# EAGLE design source_eagle (EAGLE 9.6.2)
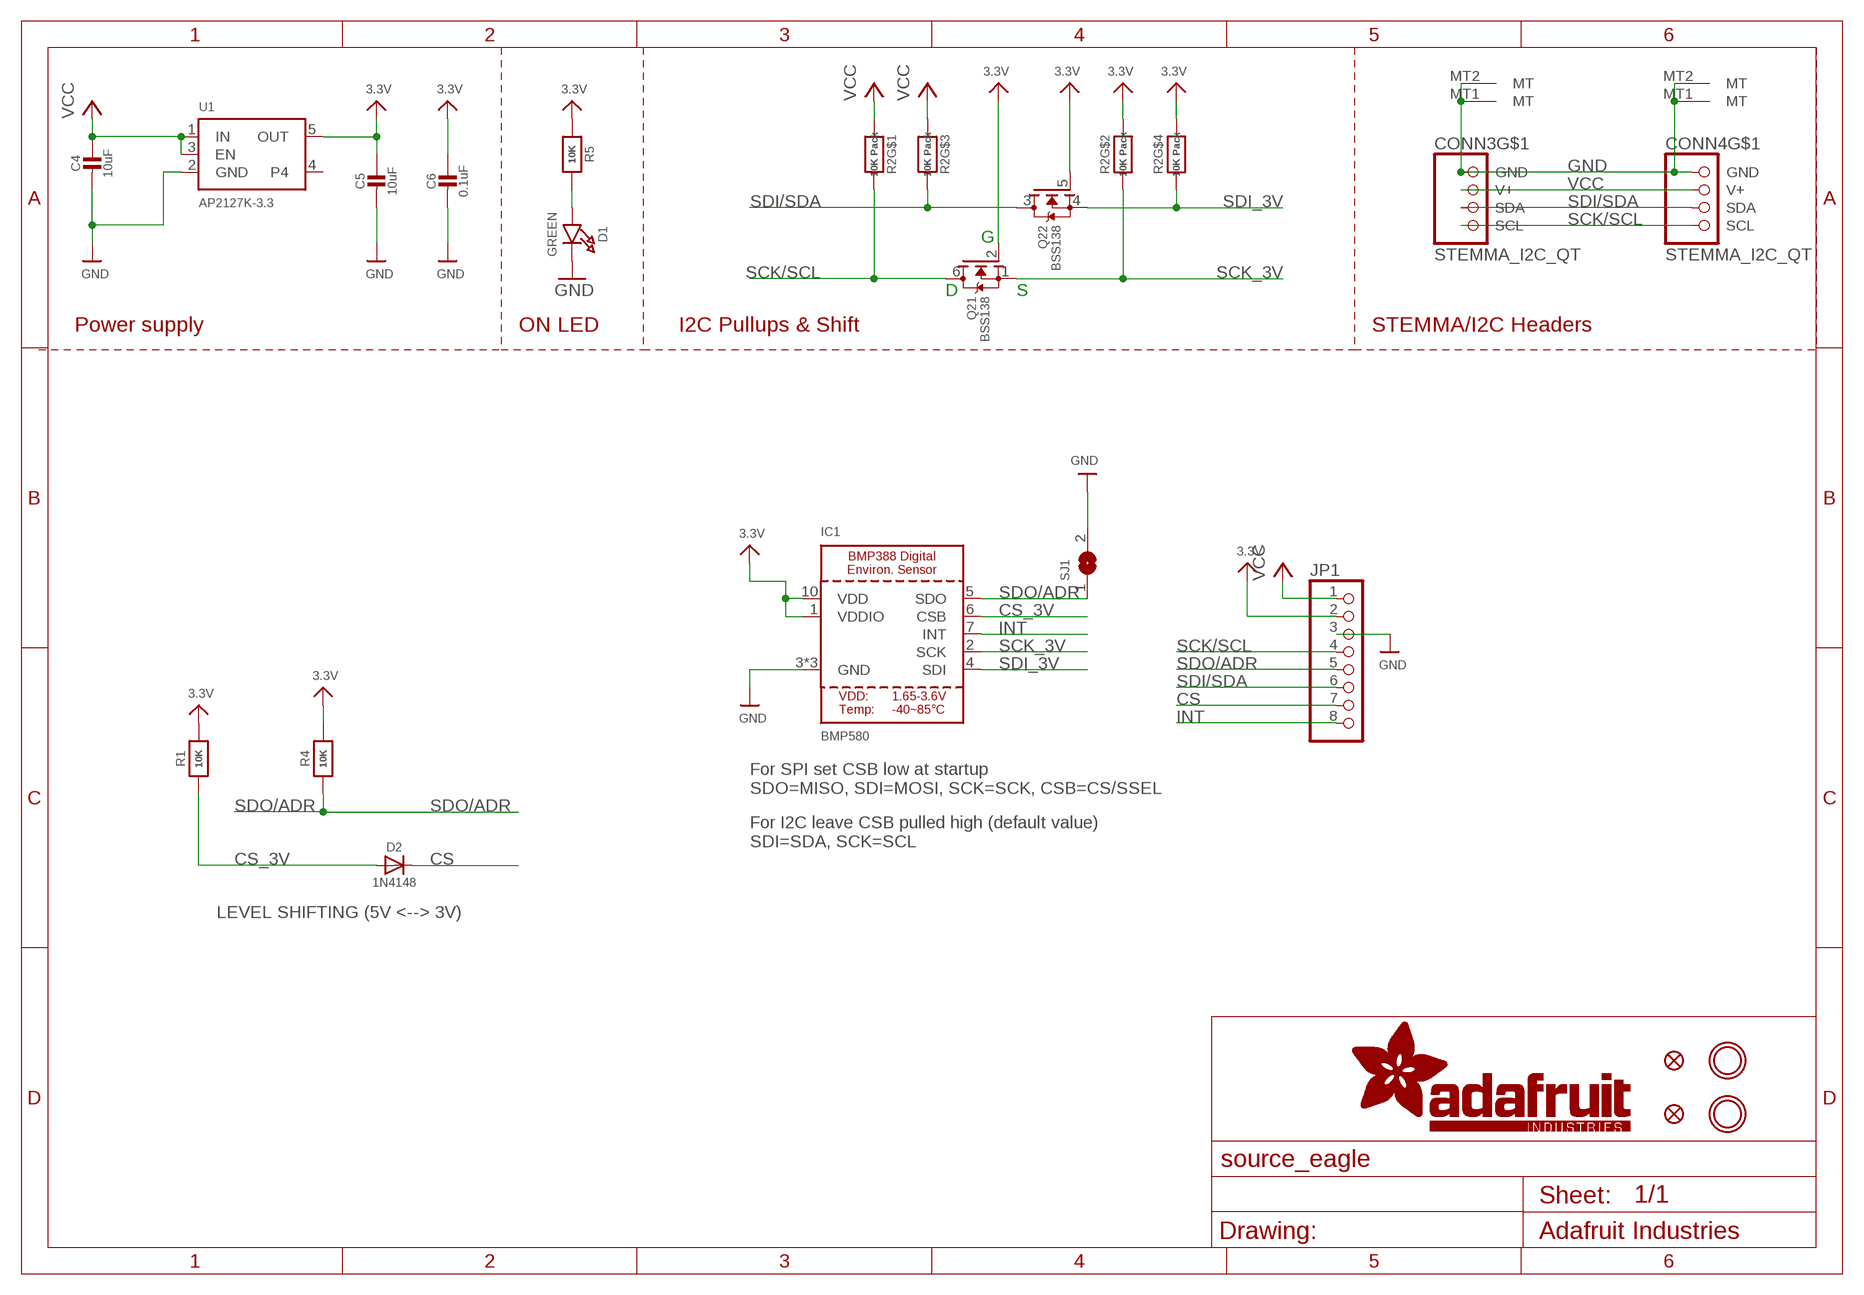
[diagram p0: schematic, sheet 1]

## Parts
C4  10uF  CAP_CERAMIC0805-NOOUTLINE  [0805-NO]
C5  10uF  CAP_CERAMIC0805-NOOUTLINE  [0805-NO]
C6  0.1uF  CAP_CERAMIC0603_NO  [0603-NO]
CONN3  STEMMA_I2C_QT  [JST_SH4]
CONN4  STEMMA_I2C_QT  [JST_SH4]
D1  GREEN  LED0603_NOOUTLINE  [CHIPLED_0603_NOOUTLINE]
D2  1N4148  DIODESOD-323  [SOD-323]
FID3  FIDUCIAL_1MM  [FIDUCIAL_1MM]
FID4  FIDUCIAL_1MM  [FIDUCIAL_1MM]
IC1  BMP580  BMP388  [BMP388]
JP1  HEADER-1X870MIL  [1X08_ROUND_70]
Q2  BSS138  MOSFET-N_DUAL  [SOT363]
R1  10K  RESISTOR_0603_NOOUT  [0603-NO]
R2  10K Pack  RESISTOR_4PACK  [RESPACK_4X0603]
R4  10K  RESISTOR_0603_NOOUT  [0603-NO]
R5  10K  RESISTOR_0603_NOOUT  [0603-NO]
SJ1  SOLDERJUMPER  [SOLDERJUMPER_ARROW_NOPASTE]
U1  AP2127K-3.3  VREG_SOT23-5  [SOT23-5]
U$40  MOUNTINGHOLE2.5  [MOUNTINGHOLE_2.5_PLATED]
U$41  MOUNTINGHOLE2.5  [MOUNTINGHOLE_2.5_PLATED]

## Nets
3.3V: C5.1 C6.1 IC1.1(VDDIO) IC1.10(VDD) JP1.2 Q2.2(1:G) Q2.5(2:G) R1.2 R2.2 R2.4 R4.2 R5.1 U1.5(OUT)
CS: D2.C JP1.7
CS_3V: D2.A IC1.6(CSB) R1.1
GND: C4.2 C5.2 C6.2 CONN3.1(GND) CONN3.MT1(MT) CONN3.MT2(MT) CONN4.1(GND) CONN4.MT1(MT) CONN4.MT2(MT) D1.C IC1.3(GND) IC1.8(GND) IC1.9(GND) JP1.3 SJ1.2 U1.2(GND)
INT: IC1.7(INT) JP1.8
N$1: D1.A R5.2
SCK/SCL: CONN3.4(SCL) CONN4.4(SCL) JP1.4 Q2.6(1:D) R2.8
SCK_3V: IC1.2(SCK) Q2.1(1:S) R2.7
SDI/SDA: CONN3.3(SDA) CONN4.3(SDA) JP1.6 Q2.3(2:D) R2.6
SDI_3V: IC1.4(SDI) Q2.4(2:S) R2.5
SDO/ADR: IC1.5(SDO) JP1.5 R4.1 SJ1.1
VCC [highpower]: C4.1 CONN3.2(V+) CONN4.2(V+) JP1.1 R2.1 R2.3 U1.1(IN) U1.3(EN)
Unconnected: U1.4

## Notes on the sheet
- G
- D | S
- Power supply | ON LED | I2C Pullups & Shift | STEMMA/I2C Headers
- For SPI set CSB low at startup
  SDO=MISO, SDI=MOSI, SCK=SCK, CSB=CS/SSEL
- For I2C leave CSB pulled high (default value)
  SDI=SDA, SCK=SCL
- LEVEL SHIFTING (5V <--> 3V)

## Library data of the parts
C4-C6 = microbuilder:CAP_CERAMIC: Ceramic Capacitors For new designs, use the packages preceded by an '_' character since they are more reliable: The following footprints should be used on most boards: _0402 - Standard footprint for regular board layouts _0603 - Standard footprint for regular board layouts _0805 - Standard footprint for regular board layouts _1206 - Standard footprint for regular board layouts For extremely tight-pitch boards where space is at a premium, the following 'micro-pitch' footprints can be used (smaller pads, no silkscreen outline, etc.): _0402MP - Micro-pitch footprint for very dense/compact boards _0603MP - Micro-pitch footprint for very dense/compact boards _0805MP - Micro-pitch footprint for very dense/compact boards _1206MP - Micro-pitch footprint for very dense/compact boards
CONN3 CONN4 = adafruit_electromech:STEMMA_I2C; LCSC: C2845363
D1 = microbuilder:LED: LED 0603 - 0603 Surface Mount Package 2mA: Green LED - Low Power (3.9mcd, 2ma, 1.7Vf) - Digikey: 475-2709-2-ND Orange LED - Low Power (9.8mcd, 2ma, 1.8Vf) - Digikey: 475-1194-2-ND Red LED - Low Power (5mcd, 2ma, 1.8Vf) - Digikey: 475-1195-2-ND Yellow LED - Low Power (7mcd, 2ma, 1.8Vf) - Digikey: 475-1196-2-ND 5mA: Blue LED - Low Power (17mcd, 5ma, 2.9Vf) - Digikey: LNJ937W8CRACT-ND 0805 - 0805 Surface Mount Package 2mA: Red LED (8.8mcd, 2mA, 1.8Vf, Clear) - Low Power [Digikey: 475-2510-1-ND] Green LED (5mcd, 2mA, 1.8Vf, Clear) - Low Power [Digikey: 475-2730-1-ND] Yellow LED (11.3mcd, 2mA, 1.8Vf, Clear) - Low Power [Digikey: 475-2555-1-ND] 20mA: Red LED (104mcd, 20mA, Diffused) - LS R976 [Digikey: 475-1278-6-ND] Red LED (12mcd, 20mA, 2.0Vf, Clear) - APT2012EC [Digikey: 754-1128-1-ND] Green LED (15mcd, 20mA, 2.2Vf, Clear) - APT2012GC [Digikey: 754-1131-1-ND] Orange LED (160mcd, 20mA, 2.1Vf, Clear) - APT2012SECK [Digikey: 754-1130-1-ND] 1206 - 1206 Surface Mount Package Green LED (26mcd, 20mA, Diffused) - LG N971 [Digikey: 475-1407-6-ND] Red LED (15mcd, 20mA, Diffused) - LH N974 [Digikey: 475-1416-6-ND] Cree - Cree High-Power Surface Mount LEDs XPEBWT-L1-0000-00D50 - White 111lm 350mA 2.9Vf 6200K 110° XTEAWT-00-0000-00000LEE3 - White 114lm 350mA 2.85Vf 5000K 115° Everlight - Everlight 45-21 Series Surface Mount LEDs 45-21/QK2C-B2832AC2CB2/2T - Warm White 2000mcd 20mA 3.25Vf 3050K 120° 45-21/LK2C-B38452C4CB2/2T - Nuetral White 2000mcd 20mA 3.25Vf 4150K 120° 45-21/LK2C-B50634C6CB2/2T - Cold White 2200mcd 20mA 3.25Vf 5650K 120° PLCC2 Reverse Mount LS T77K-J1L2-1-0-2-R18-Z - Red 11.25mcd 2mA 1.8Vf 630nm 120° LO T77K-L1M2-24-Z - Orange 19.6mcd 2mA 1.8Vf 606nm 120° LY T77K-K2M1-26-Z - Yellow 15.7mcd 2mA 1.8Vf 587nm 120°; ROT: 270
D2 = microbuilder:DIODE: Diode SMA Model Volts Amps Type Vf Ir Digikey # Notes SSA34-E3 40V 3A Schottky 480mV @ 3A 200uA @ 40V SSA34-E3/61TGITR-ND CDBA120-G 20V 1A Schottky 500mV @ 1A 500uA @ 20V 641-1014-6-ND REEL MBRA210 10V 2A Schottky 350mV @ 2A 700uA @ 10V MBRA210LT3 SOD-123 Model Volts Amps Type Vf Ir Order # Notes BAT54T1G 30V 200mA Schottky 800mV @ 200mA 2uA @ 25V BAT54T1GOSTR-ND B0530W 30V 500mA Schottky 430mV @ 500mA 130uA @ 30V B0530W-FDICT-ND REEL MBR120 20V 1A Schottky 340mV @ 1A MBR120VLSFT1GOSCT-ND SOD-323 Model Volts Amps Type Vf Ir Order # Notes PMEG2005EJ 20V 500mA Schottky 355mV @ 500mA 568-4110-1-ND ZLLS410 10V 570mA Schottky 380mV @ 570mA ZLLS410CT-ND 1N4148WS 75V 150mA Silicon/Simple 1V 1N4148WSFSCT-ND REEL SOD-523 Model Volts Amps Type Vf Ir Order # Notes BAT54XV2 30V 200mA Schottky 0.8V @ 100mA BAT54XV2CT-ND TB751S 30V 30mA Schottky RB751S-40TE61CT-ND SOT23-R/W (R = Solder Paste/Reflow Ovens, W = Hand-Soldering) Model Volts Amps Type Vf Ir Order # Notes BAT54FILM 40V 300mA Schottky 497-7162-1-ND POWERDI-5 Model Volts Amps Type Vf Ir Order # Notes PDS560 60V 5A Schottky 670mV @ 5A 150uA @ 60V PDS560DICT-ND
FID3 FID4 = microbuilder:FIDUCIAL: Fiducial Alignment Points Various fiducial points for machine vision alignment.; BOM: EXCLUDE
IC1 = adafruit_sensor:BMP388
JP1 = microbuilder:HEADER-1X8: PIN HEADER
Q2 = microbuilder:MOSFET-N_DUAL: Dual N-Channel MOSFET SOT363 (2.0x1.25mm) 2N7002PS - 60V, 320mA [Digikey: 568-5984-1-ND]; JLC_ROTATION: 270
R1 R4 R5 = microbuilder:RESISTOR: Resistors For new designs, use the packages preceded by an '_' character since they are more reliable: The following footprints should be used on most boards: _0402 - Standard footprint for regular board layouts _0603 - Standard footprint for regular board layouts _0805 - Standard footprint for regular board layouts _1206 - Standard footprint for regular board layouts For extremely tight-pitch boards where space is at a premium, the following 'micro-pitch' footprints can be used (smaller pads, no silkscreen outline, etc.): _0402MP - Micro-pitch footprint for very dense/compact boards _0603MP - Micro-pitch footprint for very dense/compact boards _0805MP - Micro-pitch footprint for very dense/compact boards _1206MP - Micro-pitch footprint for very dense/compact boards
R2 = microbuilder:RESISTOR_4PACK: Resistor Packs (4 resistors) 4 x 0603 10K 1/16W - Digikey: YC164J-10KCT-ND
SJ1 = microbuilder:SOLDERJUMPER: SMD Solder JUMPER Solder the two pads together to create a connection, or remove the solder to break it. REFLOW - Use this footprint for solder paste and reflow ovens. WAVE - Use this footprint for hand-soldering (larger pads). CLOSED - Has a trace between the two pads to ensure it is closed by default. The trace needs to be cut to disable the jumper, and can be closed again by creating a solder bridge between the two pads.; BOM: EXCLUDE
U1 = adafruit_power:VREG_SOT23-5: SOT23-5 Fixed Voltage Regulators Part Current Out V Out V In V Dropout θJA (°C/W) TJ (°C) Digikey Part No. ADP121 150mA 3.3V 3.4-5.5V 0.09V @ 150mA -- -- ADP121-AUJZ33R7CT-ND ADP121 150mA 3.0V 3.1-5.5V 0.09V @ 150mA -- -- ADP121-AUJZ30R7CT-ND ADP122 300mA 3.3V 3.4-5.5V 0.085V @ 300mA -- -- ADP122AUJZ-3.3-R7CT-ND ADP1712 300mA 3.3V 3.5-5.5V 0.17V @ 300mA -- -- ADP1712AUJZ-3.3-R7TR-ND AP7311 (Low Cost) 150mA 3.3V 3.5-6V 0.15V @ 150mA -- -- AP7311-33WG-7DICT-ND LD39015M18R 150mA 1.8V 1.9V-5.5V 0.08V @ 100mA -- -- 497-6977-1-ND LP2985A-33DBVR 150mA 3.3V 3.3-16V 0.28V @ 150mA 206 150 296-18479-1-ND MCP1824T-3302E/OT 300mA 3.3V 3.5V-6V 0.2V @ 300mA -- -- MCP1824T-3302E/OTCT-ND MIC5205-2.5YM5 TR 150mA 2.5V 2.7-16V 0.165V @ 150mA -- -- 576-1257-2-ND MIC5205-3.0YM5 TR 150mA 3.0V 3.2V-16V 0.165V @ 150mA -- -- 576-1258-2-ND MIC5205-3.3YM5 TR 150mA 3.3V 3.5V-16V 0.165V @ 150mA -- -- 576-1259-2-ND TPS780330220 150mA 3.3V+2.2V 3.6-5.5V 250mV Max -- -- 296-23332-1-ND TDA3663/N1,135 100mA 3.3V 3.5-45V 0.18V @ 50mA -- -- 568-5343-1-ND Max operating temp can be calculated using θJA, TJ (max junction temperature), and power in watts. Set the "Maximum Ambient Temperature" until it reaches TJ ("Max Junction Temperature"), which is the absolute limit for safe use of the regulator: Heat Sink Temperature Calculator <http://www.daycounter.com/Calculators/Heat-Sink-Temperature-Calculator.phtml> For example, With 12V source into a 3.3V LP2985 and a 30mA load, we are dissipating (12V-3.3V) * 0.03A = 0.261W. With a θJA of 206 °C/W, a TJ of 150°C, and 261mW we can safely use the chip without a heat sink up to 75°C (=147.1°C Junction Temperature).; JLC_ROTATION: 270
U$40 U$41 = adafruit_electromech:MOUNTINGHOLE: Mounting Hole For #2 screws (0.086"/2.18mm width, 0.094"/2.4mm hole) use 2.5mm; BOM: EXCLUDE

## Net classes
1 highpower: width 0.305 mm, drill 0.483 mm
2 lowpower: width 0.254 mm, drill 0.483 mm

## Board
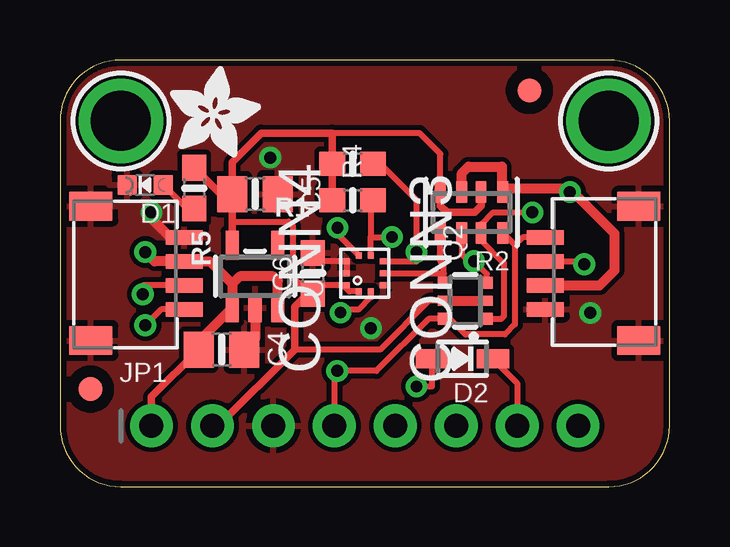
[diagram p1: board, top side]
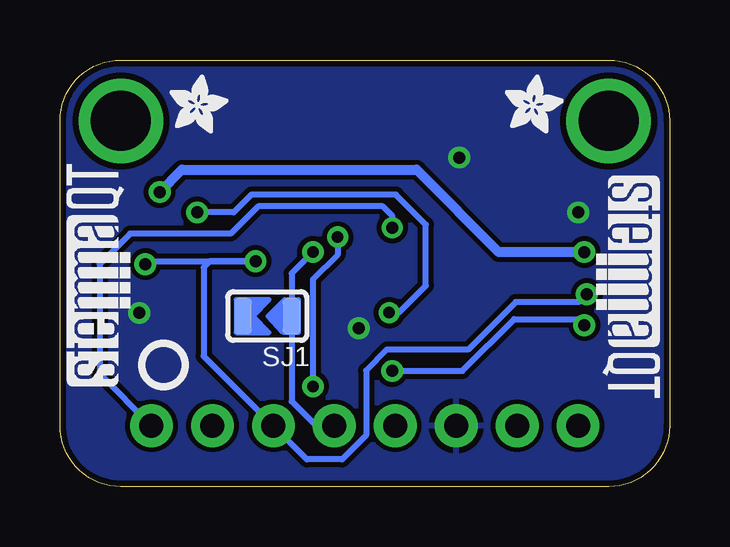
[diagram p2: board, bottom side, seen from below]

Size 25.4 x 17.78 mm. Coordinates in mm from the lower left corner, seen from the top.
Outline: 0,15.24 0,2.54 arc90 2.54,0 22.86,0 arc90 25.4,2.54 25.4,15.24 arc90 22.86,17.78 2.54,17.78 arc90 0,15.24
Copper layers (1*16): Top 0.035mm / dielectric 1.5mm / Bottom 0.035mm
Design rules "adafruit *": minimum track width 8mil, minimum drill 15.5mil, track to track 8mil, track to pad 8mil, pad to pad 8mil, via to via 8mil, smd to smd 8mil, copper to edge 10mil, drill to drill 8mil, minimum pad ring 10mil, minimum via ring 8mil, stop-mask expansion 2mil, vias tented up to drill 20mil, thermal gap 10mil

### Footprints (pad centres in the part's own frame; a part is rotated, then mirrored left to right if it is on the bottom)
0805-NO = smd 1.24 x 1.5: 1 -0.95,0; 2 0.95,0
0603-NO = smd 1.075 x 1: 1 -0.85,0; 2 0.85,0
JST_SH4 = smd 0.6 x 1.55: 1 -1.5,2.006; 2 -0.5,2.006; 3 0.5,2.006; 4 1.5,2.006 | smd 1.2 x 1.8: MT1 -2.8,-1.894; MT2 2.8,-1.894
CHIPLED_0603_NOOUTLINE = smd 0.8 x 0.8: A 0,-0.75; C 0,0.75
SOD-323 = smd 1.35 x 0.8: A 1.27,0; C -1.27,0
FIDUCIAL_1MM = smd 1 x 1: 1 0,0
BMP388 = smd 0.25 x 0.275: 1 0.25,0.75; 2 -0.25,0.75; 6 -0.25,-0.75; 7 0.25,-0.75 | smd 0.275 x 0.25: 3 -0.762,0.5; 4 -0.762,0; 5 -0.762,-0.5; 8 0.762,-0.5; 9 0.762,0; 10 0.762,0.5
1X08_ROUND_70 = drill 1 pad 1.778: 1 -8.89,0; 2 -6.35,0; 3 -3.81,0; 4 -1.27,0; 5 1.27,0; 6 3.81,0; 7 6.35,0; 8 8.89,0
SOT363 = smd 0.5 x 0.5: 1 -0.75,-0.9; 3 0.75,-0.9; 4 0.75,0.9; 6 -0.75,0.9 | smd 0.4 x 0.5: 2 0,-0.9; 5 0,0.9
RESPACK_4X0603 = smd 0.45 x 0.9: 1 -1.3,-0.85; 2 -0.4,-0.85; 3 0.4,-0.85; 4 1.3,-0.85; 5 1.3,0.85; 6 0.4,0.85; 7 -0.4,0.85; 8 -1.3,0.85
SOLDERJUMPER_ARROW_NOPASTE = smd 0.762 x 1.524: 1 -1.016,0; 2 1.016,0
SOT23-5 = smd 0.55 x 1.2: 1 -0.95,-1.3; 2 0,-1.3; 3 0.95,-1.3; 4 0.95,1.3; 5 -0.95,1.3
MOUNTINGHOLE_2.5_PLATED = drill 2.5 pad 3.2: P$1 0,0

### Placement (x,y rotation side)
C4  6.73,5.71 0 top
C5  8.13,12.19 0 top
C6  10.54,8.89 90 top
CONN3  22.23,8.89 90 top
CONN4  3.17,8.89 270 top
D1  3.56,12.57 90 top
D2  16.76,5.33 180 top
FID3  1.27,4.06 0 top
FID4  19.56,16.51 0 top
IC1  12.7,8.89 180 top
JP1  12.7,2.54 0 top
PLABEL14  [PLABEL14]  13.34,7.49 0 bottom
PLABEL15  [PLABEL15]  12.45,3.68 0 top
PLABEL16  [PLABEL16]  18.03,3.68 0 top
PLABEL17  [PLABEL17]  6.48,0.89 0 top
PLABEL18  [PLABEL18]  9.02,4.19 0 top
PLABEL19  [PLABEL19]  11.56,0.89 0 top
PLABEL20  [PLABEL20]  16.64,0.89 0 top
PLABEL21  [PLABEL21]  21.97,0.89 0 top
PLABEL22  [PLABEL22]  13.72,16.64 0 top
PLABEL23  [PLABEL23]  13.97,14.86 0 top
PLABEL24  [PLABEL24]  12.83,11.3 0 bottom
PLABEL25  [PLABEL25]  12.7,15.88 0 bottom
PLABEL26  [PLABEL26]  12.57,0.89 0 bottom
PLABEL27  [PLABEL27]  19.05,4.32 0 bottom
Q2  16.89,7.75 90 top
R1  12.19,11.94 180 top
R2  17.14,11.43 180 top
R4  12.19,13.46 180 top
R5  5.59,12.45 270 top
SJ1  16.76,7.11 180 bottom
U1  8.13,8.76 0 top
U$1  GND  [ADAFRUIT_2.5MM]  6.86,14.73 0 bottom
U$2  [ADAFRUIT_2.5MM]  20.83,14.73 0 bottom
U$40  2.54,15.24 0 top
U$41  22.86,15.24 0 top
U$46  [ADAFRUIT_3.5MM]  4.57,13.72 0 top
U$47  [PCBFEAT-REV-040]  21.08,5.08 0 bottom
U$48  [STEMMAQT]  22.48,4.19 90 bottom
U$49  [STEMMAQT]  3.05,12.95 270 bottom

### Tracks (layer width: path | path; a pad name or v marks a point on that pad's centre or on a via)
3.3V
  Top 0.254: 7.18,11.05 9.53,11.05 9.72,10.86 9.72,10.42 9.71,10.41 9.71,8.7 10.38,8.04 C6.1 10.89,8.39 11.81,8.39 | IC1.10 11.81,8.39 | IC1.1 12.06,8.14 11.81,8.39 | R2.4 15.85,13.87 14.99,14.73 11.34,14.73 | Q2.5 15.37,7.75 13.34,5.71 9.78,5.71
  Top 0.305: R2.2 17.55,11.7 17.27,11.43 16.13,11.43 15.85,11.71 R2.4 | C5.1 7.18,11.05 U1.5 | R5.1 6.69,12.19 C5.1 | C5.1 7.18,13.53 8.38,14.73 11.34,14.73 R4.2 R1.2 | JP1.2 6.6,2.54 9.78,5.71 9.78,7.49 10.33,8.04 C6.1
  Top 0.406: Q2.5 Q2.2
CS
  Top 0.254: D2.C 19.05,4.32 JP1.7
CS_3V  (via drill 0.48)
  Top 0.254: IC1.6 12.95,10.39 12.94,10.4 | R1.1 12.95,11.85 12.95,10.41 12.94,10.4 | 12.94,10.4 v13.83,10.4 | v14.86,4.18 15.49,4.18 D2.A
  Bottom 0.254: v13.83,10.4 13.83,9.66 14.86,8.64 v14.86,4.18
GND  (via drill 0.5)
  Top 0.254: IC1.9 IC1.8 10.89,9.39 C6.2
  Top 0.406: U1.2 8.13,6.16 C4.2 | CONN4.1 5.1,10.31 4.67,10.31 3.81,11.18 v3.81,11.43
  other vias: 22.1,7.24 8.76,13.72 12.95,6.6
  pour Top: 0,17.78 25.4,17.78 25.4,0 0,0
  pour Bottom: 0,17.78 25.4,17.78 25.4,0 0,0
INT  (via drill 0.48)
  Top 0.254: IC1.7 11.56,10.53 v11.56,10.79
  Bottom 0.254: v11.56,10.79 11.56,11.3 11.94,11.68 17.14,11.68 18.29,10.54 22.48,10.54 23.75,9.27 23.75,4.7 JP1.8
N$1
  Top 0.254: D1.A 5.28,11.6 R5.2
SCK/SCL  (via drill 0.5)
  Top 0.254: 18.95,10.07 18.95,6.76 18.54,6.35 16.89,6.35 16.24,7 Q2.6 15.36,7 13.19,4.83 v11.56,4.83 11.43,4.7 JP1.4 | CONN4.4 4.21,7.39 v3.56,6.73 | R2.8 18.95,10.07 | CONN3.4 19.27,10.39 18.95,10.07
  Bottom 0.254: v11.56,4.83 8.64,4.83 6.48,6.99 3.81,6.99 v3.56,6.73
SCK_3V  (via drill 0.48, 0.5)
  Top 0.254: v19.68,11.43 18.03,11.43 17.55,10.94 R2.7 17.55,10.27 18.5,9.32 18.5,7.11 18.38,7 Q2.1 | IC1.2 12.95,7.89 12.44,7.38 11.81,7.38 v11.68,7.25
  Bottom 0.254: v11.68,7.25 11.29,7.25 10.16,8.38 10.16,10.92 11.4,12.17 17.42,12.17 18.16,11.43 v19.68,11.43
SDI/SDA  (via drill 0.5)
  Top 0.254: CONN4.3 3.45,8.39 v3.45,8.02 | CONN3.3 21.73,9.39 v21.84,9.27 | R2.6 16.75,9.69 17.04,9.4 v17.25,9.4 17.79,8.86 Q2.3
  Bottom 0.254: v21.84,9.27 21.72,9.4 v17.25,9.4 19.16,9.4 19.41,9.14 19.41,5.44 JP1.6 15.11,1.14 13.64,1.14 12.65,2.14 12.65,4.84 11.78,5.71 8.39,5.71 6.41,7.7 3.78,7.7 v3.45,8.02
SDI_3V
  Top 0.254: Q2.4 15.99,8.89 | 15.99,8.89 15.99,9.26 15.85,9.4 R2.5 | IC1.4 15.99,8.89
SDO/ADR  (via drill 0.48)
  Top 0.254: IC1.5 14.86,9.39 v14.86,9.78 14.86,11.94 13.34,13.46 R4.1
  Bottom 0.203: SJ1.1 15.75,6.6
  Bottom 0.254: v14.86,9.78 15.75,8.89 SJ1.1 | JP1.5 14.73,2.54 15.75,3.56 15.75,6.6
VCC  (via drill 0.5)
  Top 0.305: C4.1 3.81,3.74 JP1.1
  Top 0.406: R2.3 16.75,13.06 17.02,13.34 18.41,13.34 18.41,12.31 R2.1 18.57,12.41 21.12,12.41 v21.25,12.28 21.38,12.28 23.11,10.54 23.11,9.02 22.49,8.39 CONN3.2 | C4.1 5.78,6.07 U1.1 7.18,8.45 | U1.3 9.08,8.57 8.89,8.76 7.49,8.76 7.18,8.45 | 7.18,8.45 6.24,9.39 CONN4.2 3.94,9.39 v3.56,9.78
  Bottom 0.406: v21.25,12.28 20.32,13.21 10.54,13.21 7.11,9.78 v3.56,9.78

### Text on the board
Pinguin_tBackup: BMP580 | Temp & Pressure | on | SDO | CS | VIN | GND | 3Vo | SCL | SDA | INT
Pinguin_bBackup: BMP580 | Precision Altitude / Barometric Pressure & / Temp Sensor (SPI/I2C) | Default I2C 0x47 | addr | Default I2C addr 0x47 | VLogic/Vcc: 3-5VDC